# EAGLE design tec_controller_v1 (EAGLE 7.2.0)
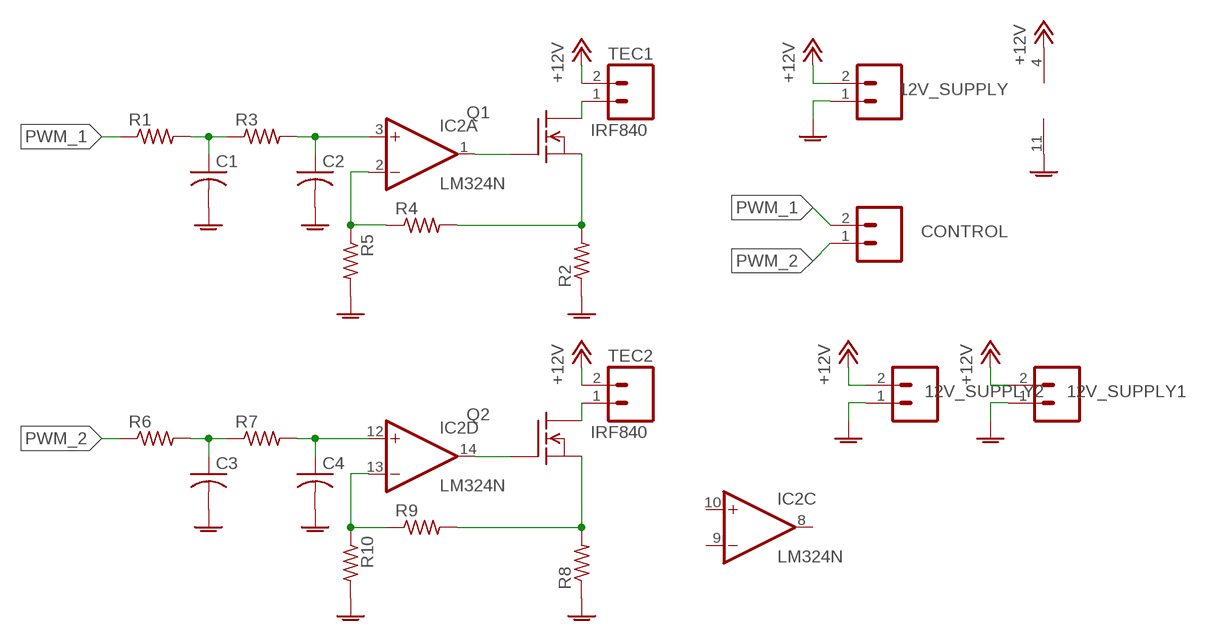
[diagram p0: schematic, sheet 1]

## Parts
12V_SUPPLY  M02LOCK_LONGPADS  [1X02_LOCK_LONGPADS]
12V_SUPPLY1  M02LOCK_LONGPADS  [1X02_LOCK_LONGPADS]
12V_SUPPLY2  M02LOCK_LONGPADS  [1X02_LOCK_LONGPADS]
C1  C-USC0805  [C0805]
C2  C-USC0805  [C0805]
C3  C-USC0805  [C0805]
C4  C-USC0805  [C0805]
CONTROL  M02LOCK_LONGPADS  [1X02_LOCK_LONGPADS]
IC2  LM324N  [DIL14]
Q1  IRF840  [TO220]
Q2  IRF840  [TO220]
R1  R-US_M0805  [M0805]
R2  R-US_V235/17  [V235/17]
R3  R-US_M0805  [M0805]
R4  R-US_M0805  [M0805]
R5  R-US_M0805  [M0805]
R6  R-US_M0805  [M0805]
R7  R-US_M0805  [M0805]
R8  R-US_V235/17  [V235/17]
R9  R-US_M0805  [M0805]
R10  R-US_M0805  [M0805]
TEC1  M02LOCK_LONGPADS  [1X02_LOCK_LONGPADS]
TEC2  M02LOCK_LONGPADS  [1X02_LOCK_LONGPADS]

## Nets
+12V: 12V_SUPPLY1.2 12V_SUPPLY2.2 12V_SUPPLY.2 IC2.4(P:V+) TEC1.2 TEC2.2
GNDA: 12V_SUPPLY1.1 12V_SUPPLY2.1 12V_SUPPLY.1 C1.2 C2.2 C3.2 C4.2 IC2.11(P:V-) R2.1 R5.2 R8.1 R10.2
N$1: Q1.2(D) TEC1.1
N$2: Q1.3(S) R2.2 R4.2
N$3: IC2.1(A:OUT) Q1.1(G)
N$4: C1.1 R1.2 R3.1
N$5: C2.1 IC2.3(A:+IN) R3.2
N$6: IC2.2(A:-IN) R4.1 R5.1
N$7: C3.1 R6.2 R7.1
N$8: C4.1 IC2.12(D:+IN) R7.2
N$9: Q2.2(D) TEC2.1
N$10: Q2.3(S) R8.2 R9.2
N$11: IC2.14(D:OUT) Q2.1(G)
N$12: IC2.13(D:-IN) R9.1 R10.1
PWM_1: CONTROL.2 R1.1
PWM_2: CONTROL.1 R6.1
Unconnected: IC2.5(B:+IN) IC2.6(B:-IN) IC2.7(B:OUT) IC2.8(C:OUT) IC2.9(C:-IN) IC2.10(C:+IN)

## Library data of the parts
12V_SUPPLY 12V_SUPPLY1 12V_SUPPLY2 CONTROL TEC1 TEC2 = SparkFun-Connectors:M02: Standard 2-pin 0.1" header. Use with - straight break away headers ( PRT-00116) - right angle break away headers (PRT-00553) - swiss pins (PRT-00743) - machine pins (PRT-00117) - female headers (PRT-00115) Molex polarized connector foot print use with: PRT-08233 with associated crimp pins and housings. 2.54_SCREWTERM for use with PRT-10571. 3.5mm Screw Terminal footprints for PRT-08084 5mm Screw Terminal footprints for use with PRT-08433
C1-C4 = rcl:C-US: CAPACITOR, American symbol
IC2 = linear:LM324: OP AMP
Q1 Q2 = transistor-fet:IRF840: N-Channel Enhancement MOSFET (HEXFET); 500V; 8A; 0,85Ohm
R1-R10 = rcl:R-US_: RESISTOR, American symbol

## Board
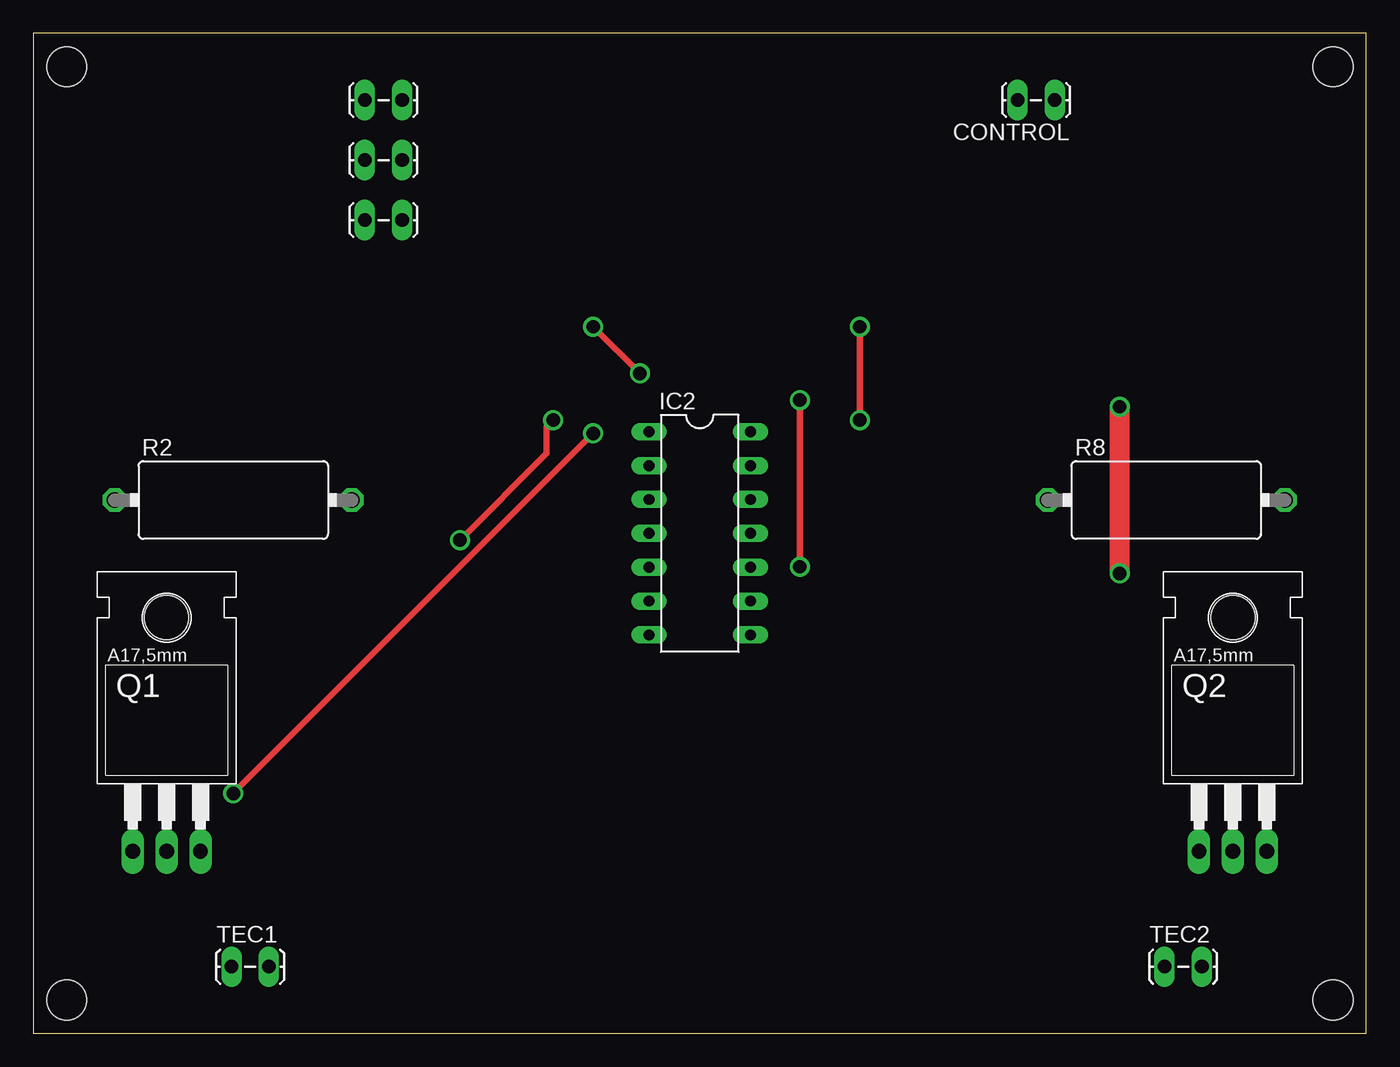
[diagram p1: board, top side]
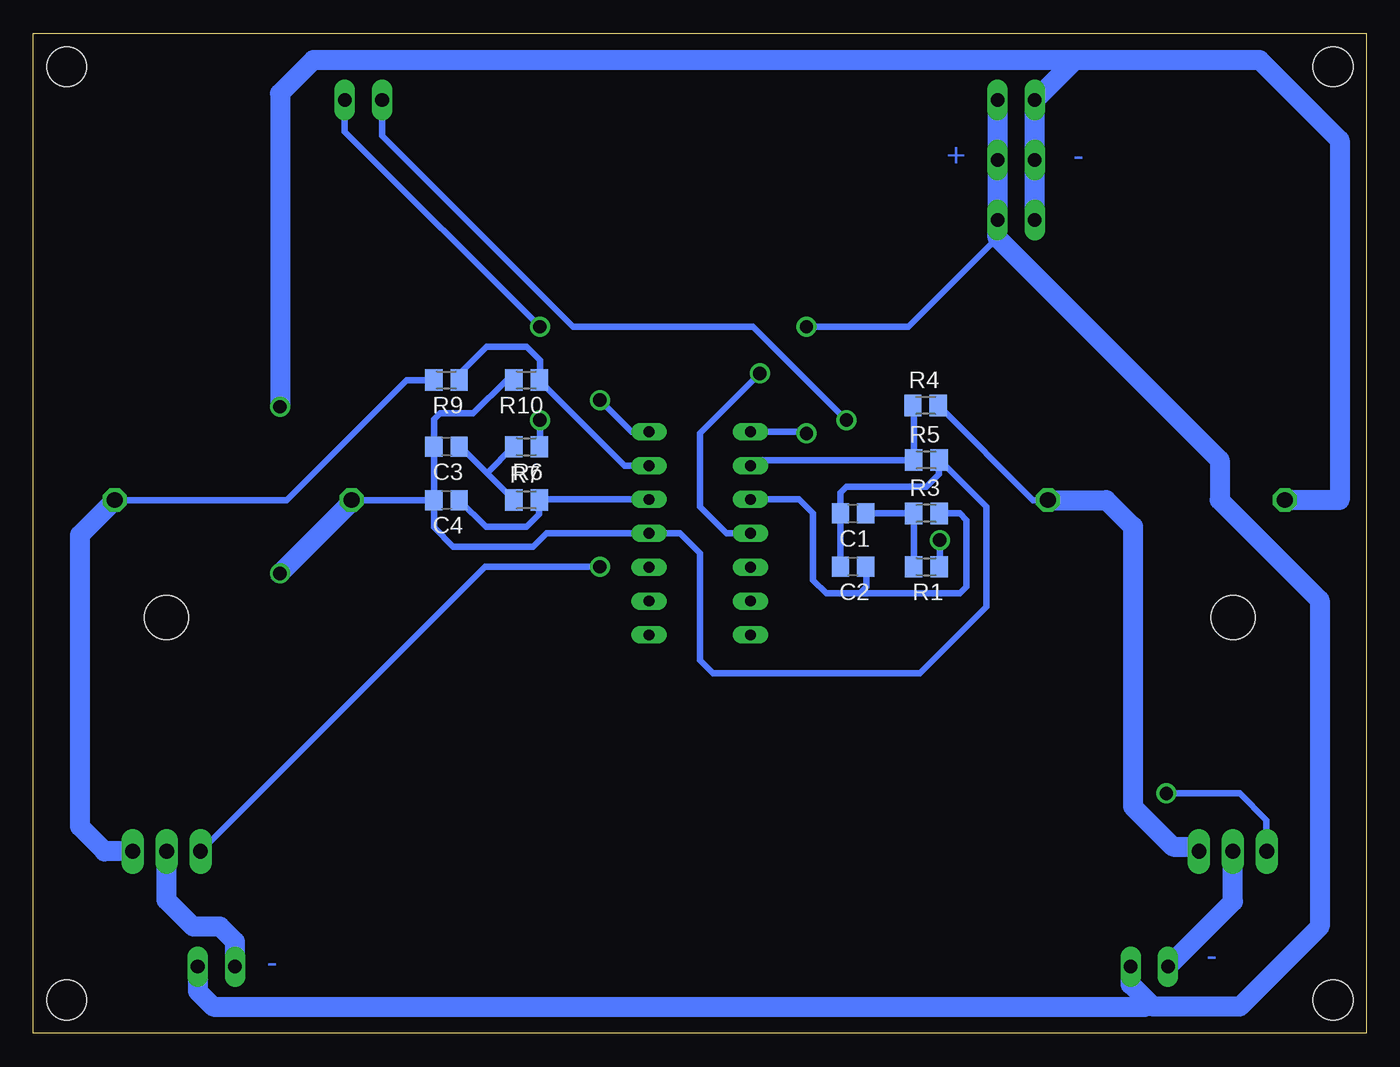
[diagram p2: board, bottom side, seen from below]

Size 100 x 75 mm. Coordinates in mm from the lower left corner, seen from the top.
Outline: 0,0 100,0 100,75 0,75 0,0
Copper layers (1*16): Top 0.035mm / dielectric 1.5mm / Bottom 0.035mm
Design rules "default *": minimum track width 10mil, minimum drill 24mil, track to track 15mil, track to pad 15mil, pad to pad 15mil, via to via 15mil, smd to smd 15mil, copper to edge 40mil, drill to drill 8mil, minimum pad ring 10mil, minimum via ring 8mil, stop-mask expansion 4mil, vias tented up to drill 0mil, thermal gap 10mil
Holes 3 mm at 2.5,72.5 97.5,72.5 97.5,2.5 2.5,2.5

### Footprints (pad centres in the part's own frame; a part is rotated, then mirrored left to right if it is on the bottom)
1X02_LOCK_LONGPADS = drill 1.016 long: 1 -0.127,0; 2 2.667,0
C0805 = smd 1.3 x 1.5: 1 -0.95,0; 2 0.95,0
DIL14 = drill 0.813 long: 1 -7.62,-3.81; 2 -5.08,-3.81; 3 -2.54,-3.81; 4 0,-3.81; 5 2.54,-3.81; 6 5.08,-3.81; 7 7.62,-3.81; 8 7.62,3.81; 9 5.08,3.81; 10 2.54,3.81; 11 0,3.81; 12 -2.54,3.81; 13 -5.08,3.81; 14 -7.62,3.81
TO220 = drill 1.118 long: 1 -2.54,-6.35; 2 0,-6.35; 3 2.54,-6.35 | hole 3.302: 0,11.176
M0805 = smd 1.3 x 1.6: 1 -0.95,0; 2 0.95,0
V235/17 = drill 1.194 octagon: 1 -8.89,0; 2 8.89,0

### Placement (x,y rotation side)
12V_SUPPLY  25,70 0 top
12V_SUPPLY1  25,65.5 0 top
12V_SUPPLY2  25,61 0 top
C1  38.5,39 180 bottom
C2  38.5,35 180 bottom
C3  69,44 180 bottom
C4  69,40 180 bottom
CONTROL  76.5,70 180 top
IC2  50,37.5 270 top
Q1  10,20 0 top
Q2  90,20 0 top
R1  33,35 180 bottom
R2  15,40 0 top
R3  33,39 0 bottom
R4  33.06,47.09 0 bottom
R5  33,43 0 bottom
R6  63,44 180 bottom
R7  63,40 0 bottom
R8  85,40 0 top
R9  69,49 180 bottom
R10  63,49 180 bottom
TEC1  15,5 0 top
TEC2  85,5 0 top

### Tracks (layer width: path | path; a pad name or v marks a point on that pad's centre or on a via)
+12V  (via drill 1 pad 0.5)
  Top 0.5: v42,53 v45.5,49.5
  Bottom 0.5: 27.67,59.67 34.33,53 v42,53 | v45.5,49.5 50,45 50,39.5 48,37.5 IC2.4
  Bottom 1.5: 16.25,2.25 16,2 9.5,2 3.5,8 3.5,32.5 11,40 11,43 27.67,59.67 12V_SUPPLY2.2 12V_SUPPLY1.2 12V_SUPPLY.2 | 16.25,2.25 17.67,3.67 TEC1.2 | TEC2.2 87.67,3.17 86.5,2 16.5,2 16.25,2.25
GNDA  (via drill 1 pad 0.5)
  Top 1.5: v81.5,34.5 v81.5,47
  Bottom 0.5: C2.2 C1.2 39.45,40.55 39,41 33,41 32.05,41.95 R5.2 32,43 28.5,39.5 28.5,32 33.5,27 49,27 50,28 50,36 51.5,37.5 IC2.11 61.5,37.5 62.5,36.5 68.5,36.5 69.95,37.95 C4.2 | C4.2 76,40 R8.1 | C4.2 C3.2 69.95,46.05 69.5,46.5 67,46.5 64.5,49 R10.2
  Bottom 1.5: R2.1 2,40 2,67 8,73 21.87,73 | 21.87,73 12V_SUPPLY.1 12V_SUPPLY1.1 12V_SUPPLY2.1 | 21.87,73 79,73 81.5,70.5 v81.5,47 | v81.5,34.5 76,40
N$1
  Bottom 1.5: TEC1.1 10,9.87 Q1.2
N$2
  Bottom 0.5: R2.2 25.02,40 R4.2
  Bottom 1.5: R2.2 19.5,40 17.5,38 17.5,17 14.5,14 12.89,14 Q1.3
N$3  (via drill 1 pad 0.5)
  Top 0.5: v42,45 v15,18
  Bottom 0.5: IC2.1 42.12,45.12 v42,45 | v15,18 9.5,18 7.5,16 7.5,13.69 Q1.1
N$4
  Bottom 0.5: C1.1 R3.1 R1.2
N$5
  Bottom 0.5: C2.1 37.5,34.95 37.5,33.5 38,33 | 38,33 40.5,33 41.5,34 41.5,39 42.54,40.04 IC2.3 | R3.2 30.5,39 30,38.5 30,33.5 30.5,33 38,33
N$6
  Bottom 0.5: R4.1 33.95,47.09 R5.1 45.77,43 IC2.2
N$7
  Bottom 0.5: C3.1 67.95,44 65.97,42.02 | 65.97,42.02 R7.1 | R6.2 64,44 65.97,42.02
N$8
  Bottom 0.5: C4.1 66.05,38 63,38 62.05,38.95 R7.2 62.01,40.04 IC2.12
N$9
  Bottom 1.5: TEC2.1 84.87,6.87 86,8 88,8 90,10 Q2.2
N$10
  Bottom 0.5: R8.2 81,40 72,49 R9.2
  Bottom 1.5: Q2.3 94.65,13.65 96.5,15.5 96.5,37.39 R8.2
N$11  (via drill 1 pad 0.5)
  Top 0.5: v57.5,35 v57.5,47.5
  Bottom 0.5: Q2.1 66.11,35 v57.5,35 | v57.5,47.5 55.12,45.12 IC2.14
N$12
  Bottom 0.5: R9.1 68.05,49.45 66,51.5 63,51.5 62,50.5 62,49.05 R10.1 55.63,42.58 IC2.13
PWM_1  (via drill 1 pad 0.5)
  Top 0.5: v32,37 38.5,43.5 38.5,45.5 v39,46
  Bottom 0.5: v39,46 46,53 59.5,53 73.83,67.33 CONTROL.2 | R1.1 32,35.05 v32,37
PWM_2  (via drill 1 pad 0.5)
  Top 0.5: v62,46 v62,53
  Bottom 0.5: R6.1 62,44.05 v62,46 | v62,53 76.63,67.63 CONTROL.1

### Text on the board
Bottom: - | + | - | -